# Altium schematic sheet Driver Board Simplified.SchDoc
size A
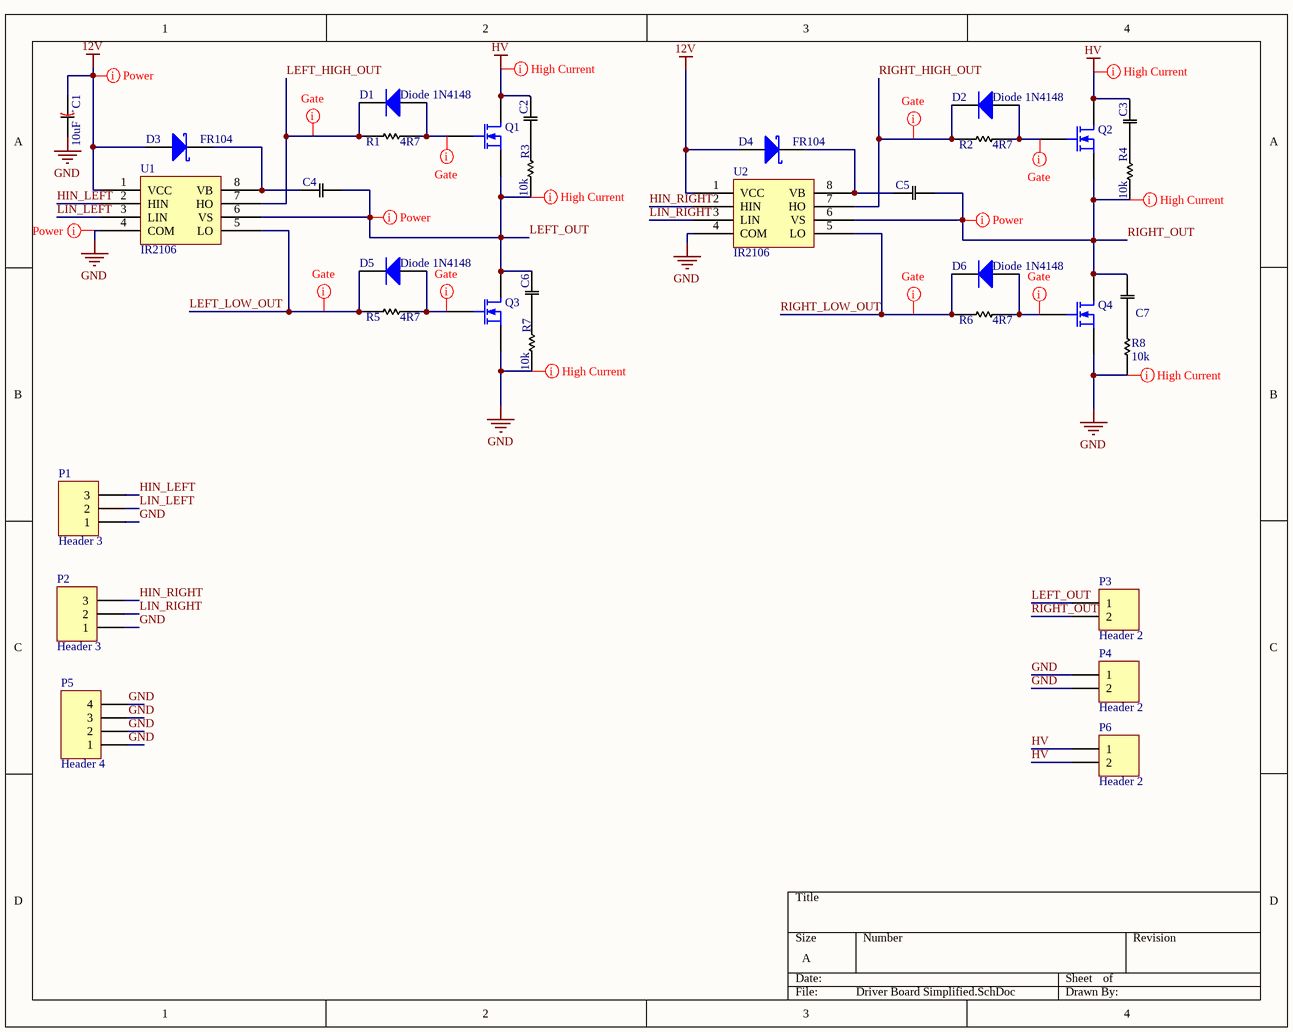
[diagram p0: Driver Board Simplified.SchDoc]

## Parts
C1  10uF  [100mil CAP - 80mil pad]
C2  Ceramic Cap  [6-0805_N]  (value not drawn)
C3  Ceramic Cap  [6-0805_N]  (value not drawn)
C4  Ceramic Cap  [6-0805_L]  (value not drawn)
C5  Ceramic Cap  [6-0805_L]  (value not drawn)
C6  Ceramic Cap  [6-0805_N]  (value not drawn)
C7  Ceramic Cap  [6-0805_N]  (value not drawn)
D1  Diode 1N4148  [Resistor 100MIL]
D2  Diode 1N4148  [Resistor 100MIL]
D3  FR104  [DO-35]
D4  FR104  [Resistor 100MIL]
D5  Diode 1N4148  [Resistor 100MIL]
D6  Diode 1N4148  [Resistor 100MIL]
P1  Header 3  [HDR1X3]
P2  Header 3  [HDR1X3]
P3  Header 2  [2P_PCB_TERM_BLOCK_HDR]
P4  Header 2  [2P_PCB_TERM_BLOCK_HDR]
P5  Header 4  [HDR1X4]
P6  Header 2  [2P_PCB_TERM_BLOCK_HDR]
Q1  MOSFET-N  [TO-220AB]  (value not drawn)
Q2  MOSFET-N  [TO-220AB]  (value not drawn)
Q3  MOSFET-N  [TO-220AB]  (value not drawn)
Q4  MOSFET-N  [TO-220AB]  (value not drawn)
R1  4R7  [Resistor 100MIL]
R2  4R7  [Resistor 100MIL]
R3  10k  [6-0805_N]
R4  10k  [6-0805_N]
R5  4R7  [Resistor 100MIL]
R6  4R7  [Resistor 100MIL]
R7  10k  [6-0805_N]
R8  10k  [6-0805_N]
U1  IR2106  [SO8_N]
U2  IR2106  [SO8_N]

## Nets
12V: C1.1 D3.1(A) D4.1(A) U1.1(VCC) U2.1(VCC)
GND: C1.2 P1.1 P2.1 P4.1 P4.2 P5.1 P5.2 P5.3 P5.4 Q3.3(S) Q4.3(S) R7.2 R8.2 U1.4(COM) U2.4(COM)
HV: C2.1 C3.1 P6.1 P6.2 Q1.1(D) Q2.1(D)
HIN_LEFT: P1.3 U1.2(HIN)
HIN_RIGHT: P2.3 U2.2(HIN)
LEFT_HIGH_OUT: D1.2(K) R1.1 U1.7(HO)
LEFT_LOW_OUT: D5.2(K) R5.1 U1.5(LO)
LEFT_OUT: C4.1 C6.1 P3.1 Q1.3(S) Q3.1(D) R3.2 U1.6(VS)
LIN_LEFT: P1.2 U1.3(LIN)
LIN_RIGHT: P2.2 U2.3(LIN)
RIGHT_HIGH_OUT: D2.2(K) R2.1 U2.7(HO)
RIGHT_LOW_OUT: D6.2(K) R6.1 U2.5(LO)
RIGHT_OUT: C5.1 C7.1 P3.2 Q2.3(S) Q4.1(D) R4.2 U2.6(VS)
NetC2_2: C2.2 R3.1
NetC3_2: C3.2 R4.1
NetC4_2: C4.2 D3.2(K) U1.8(VB)
NetC5_2: C5.2 D4.2(K) U2.8(VB)
NetC6_2: C6.2 R7.1
NetC7_2: C7.2 R8.1
NetD1_1: D1.1(A) Q1.2(G) R1.2
NetD2_1: D2.1(A) Q2.2(G) R2.2
NetD5_1: D5.1(A) Q3.2(G) R5.2
NetD6_1: D6.1(A) Q4.2(G) R6.2

## Layout directives
net class High Current: GND, HV, LEFT_OUT, RIGHT_OUT
net class Power: 12V, GND, LEFT_OUT, RIGHT_OUT
net class Gate: LEFT_HIGH_OUT, LEFT_LOW_OUT, NetD1_1, NetD2_1, NetD5_1, NetD6_1, RIGHT_HIGH_OUT, RIGHT_LOW_OUT

## Notes on the sheet
- (in symbol Electrolytic Cap) +

## Library data of the parts
C1 = Electrolytic Cap
D1 D2 D5 D6 = Diode 1N4148: High Conductance Fast Diode; Published: 8-Jun-2000; LatestRevisionDate: 17-Jul-2002; LatestRevisionNote: Re-released for DXP Platform.; DatasheetVersion: 1997; PackageReference: DO-35; Publisher: Altium Limited; PackageDescription: Diode, Axial; Body 3.8 x 1.9 mm (LxDia. max), Lead Dia. 0.53 mm (max); Code_JEDEC: DO-204-AH; ComponentLink1Description: Manufacturer Link; ComponentLink1URL: http://www.fairchildsemi.com/; ComponentLink2Description: Datasheet; ComponentLink2URL: http://www.fairchildsemi.com/ds/1N%2F1N4148.pdf
D3 D4 = Diode 11DQ03: Schottky Rectifier; Published: 8-Jun-2000; LatestRevisionDate: 17-Jul-2002; LatestRevisionNote: Re-released for DXP Platform.; DatasheetVersion: Dec-1997; PackageReference: DO-204AL; Publisher: Altium Limited; PackageDescription: Diode, Axial; Body 5.2 x 2.7 mm (LxDia. max), Lead Dia. 0.86 mm (max); Code_JEDEC: DO-204-AL; ComponentLink1Description: Manufacturer Link; ComponentLink1URL: http://www.irf.com/; ComponentLink2Description: Datasheet; ComponentLink2URL: http://www.irf.com/product-info/datasheets/data/11dq03.pdf
P1 P2 = Header 3: Header, 3-Pin; LatestRevisionDate: 17-Jul-2002; LatestRevisionNote: Re-released for DXP Platform.; Publisher: Altium Limited
P3 P4 P6 = Header 2: Header, 2-Pin; LatestRevisionDate: 17-Jul-2002; LatestRevisionNote: Re-released for DXP Platform.; Publisher: Altium Limited
P5 = Header 4: Header, 4-Pin; LatestRevisionDate: 17-Jul-2002; LatestRevisionNote: Re-released for DXP Platform.; Publisher: Altium Limited
Q1-Q4 = MOSFET-N: N-Channel MOSFET; pin to pad: 1>2 2>1; Published: 8-Jun-2000; LatestRevisionDate: 17-Jul-2002; LatestRevisionNote: Re-released for DXP Platform.; PackageVersion: 1995/1996; PackageReference: E3; Publisher: Altium Limited; PackageDescription: TO, Flat Index; 3 In-Line, Axial Leads; Body Dia. 4.6mm; Lead Dia. 0.5 mm (max)
R1-R8 = Resistor